# Altium schematic sheet IO_USB.schdoc
size 354 x 295 mm
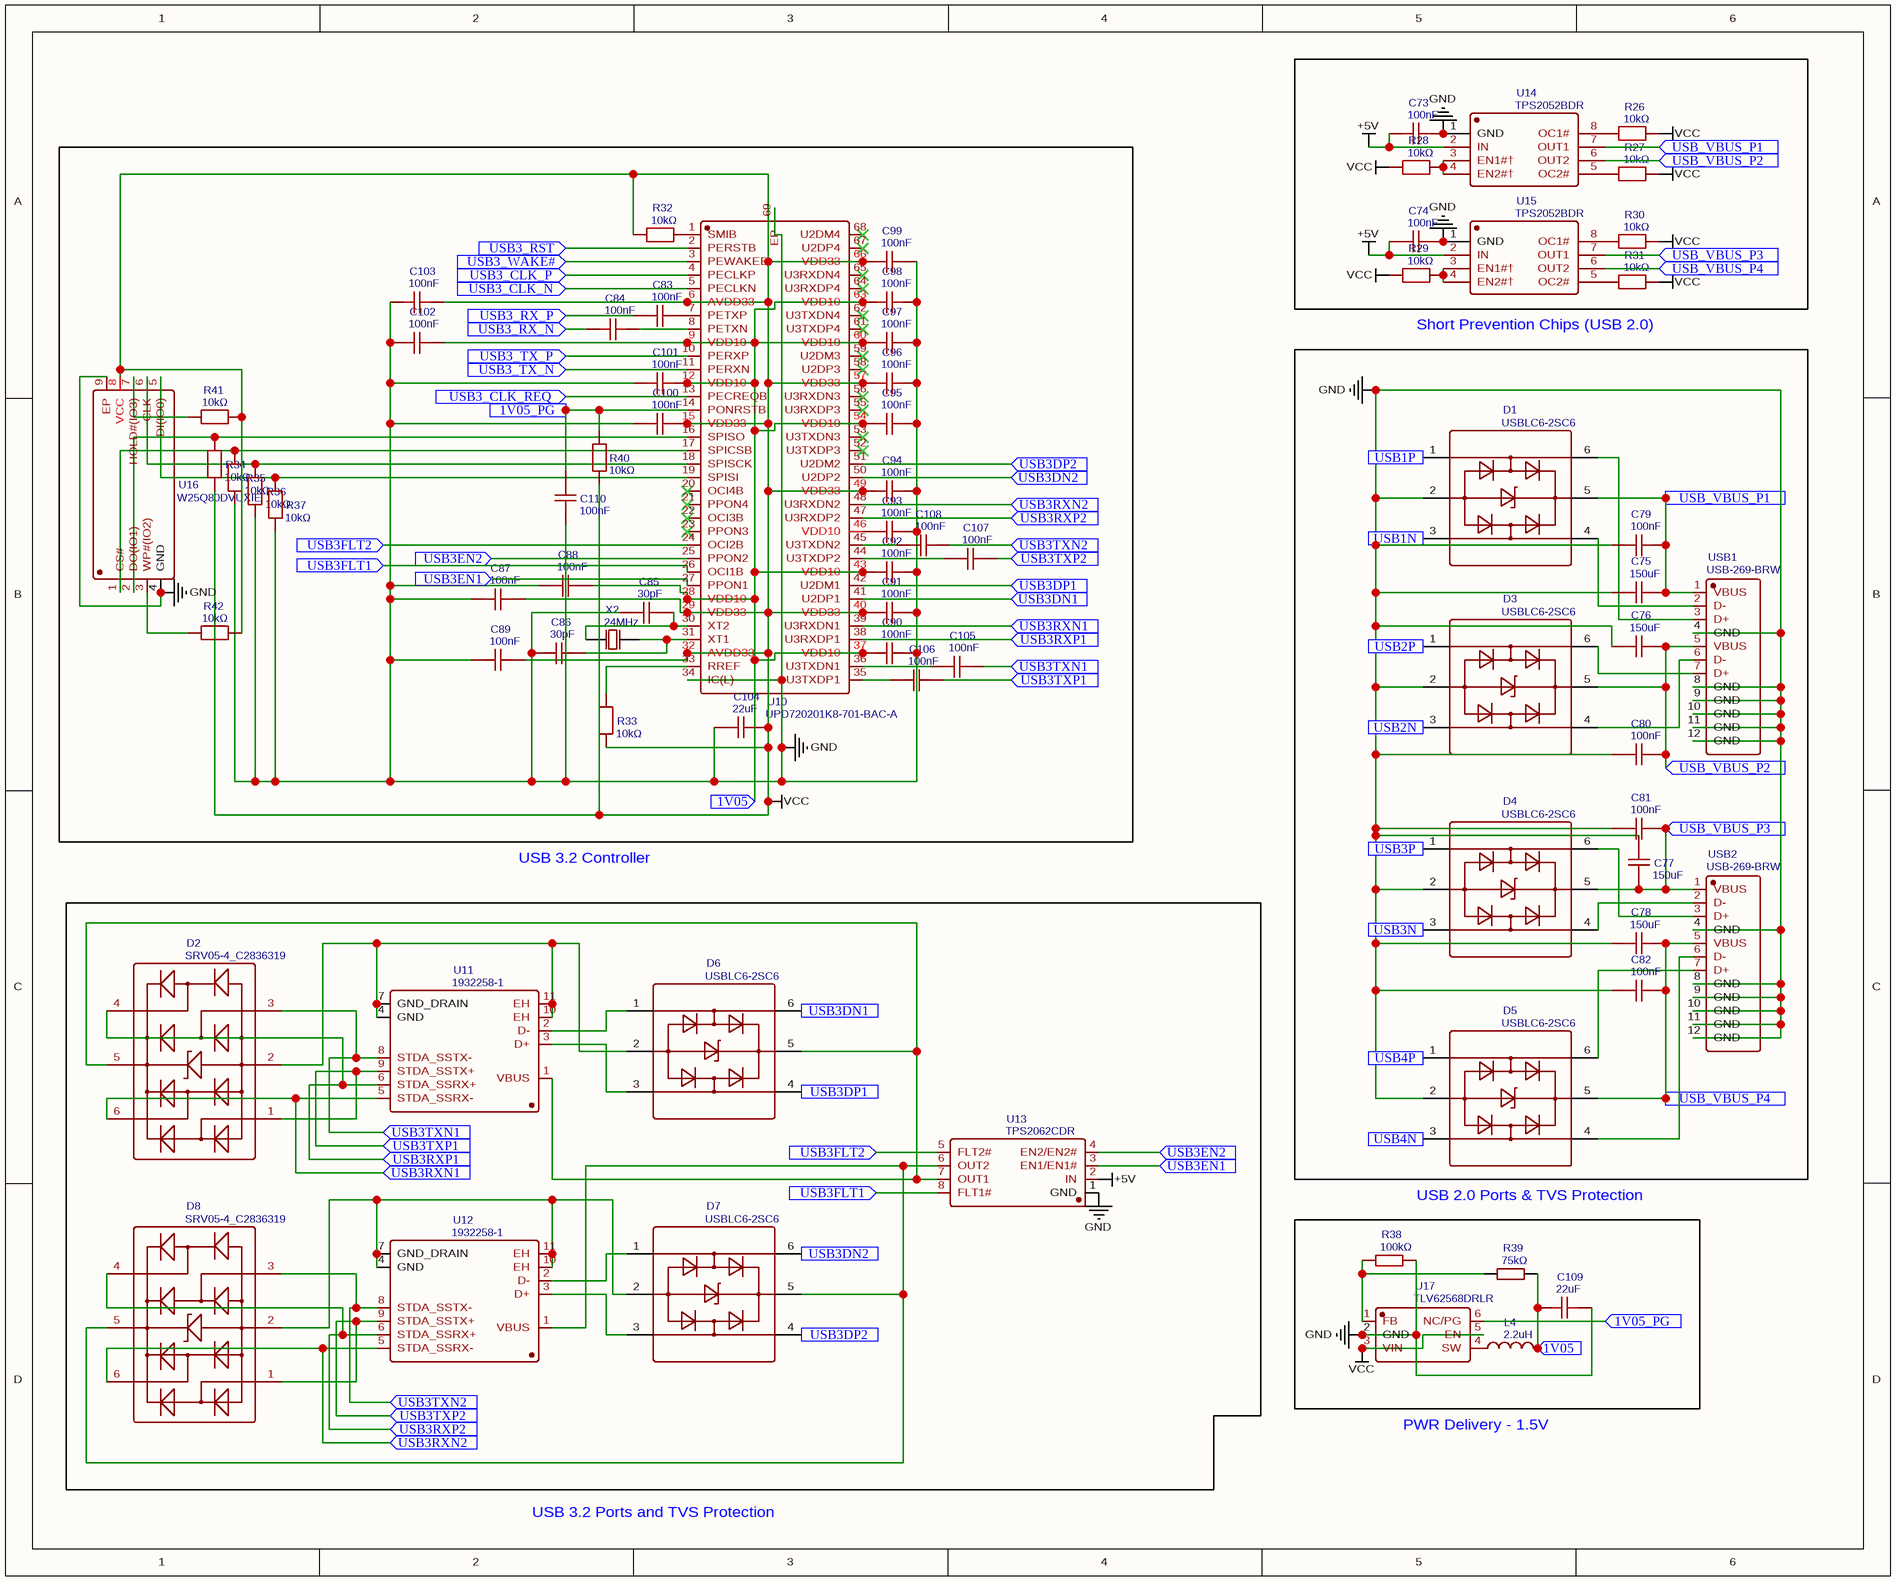
[diagram p0: IO_USB.schdoc]

## Parts
C73  100nF  [C0402]
C74  100nF  [C0402]
C75  150uF  [C1206]
C76  150uF  [C1206]
C77  150uF  [C1206]
C78  150uF  [C1206]
C79  100nF  [C0402]
C80  100nF  [C0402]
C81  100nF  [C0402]
C82  100nF  [C0402]
C83  100nF  [C0402]
C84  100nF  [C0402]
C85  30pF  [C0402]
C86  30pF  [C0402]
C87  100nF  [C0402]
C88  100nF  [C0402]
C89  100nF  [C0402]
C90  100nF  [C0402]
C91  100nF  [C0402]
C92  100nF  [C0402]
C93  100nF  [C0402]
C94  100nF  [C0402]
C95  100nF  [C0402]
C96  100nF  [C0402]
C97  100nF  [C0402]
C98  100nF  [C0402]
C99  100nF  [C0402]
C100  100nF  [C0402]
C101  100nF  [C0402]
C102  100nF  [C0402]
C103  100nF  [C0402]
C104  22uF  [C0805]
C105  100nF  [C0402]
C106  100nF  [C0402]
C107  100nF  [C0402]
C108  100nF  [C0402]
C109  22uF  [C0805]
C110  100nF  [C0402]
D1  USBLC6-2SC6  [SOT-23-6_L2.9-W1.6-P0.95-LS2.8-BL]
D2  SRV05-4_C2836319  [SOT-23-6_L2.9-W1.6-P0.95-LS2.8-BL]
D3  USBLC6-2SC6  [SOT-23-6_L2.9-W1.6-P0.95-LS2.8-BL]
D4  USBLC6-2SC6  [SOT-23-6_L2.9-W1.6-P0.95-LS2.8-BL]
D5  USBLC6-2SC6  [SOT-23-6_L2.9-W1.6-P0.95-LS2.8-BL]
D6  USBLC6-2SC6  [SOT-23-6_L2.9-W1.6-P0.95-LS2.8-BL]
D7  USBLC6-2SC6  [SOT-23-6_L2.9-W1.6-P0.95-LS2.8-BL]
D8  SRV05-4_C2836319  [SOT-23-6_L2.9-W1.6-P0.95-LS2.8-BL]
L4  2.2uH  [L0805]
R26  10kΩ  [R0402]
R27  10kΩ  [R0402]
R28  10kΩ  [R0402]
R29  10kΩ  [R0402]
R30  10kΩ  [R0402]
R31  10kΩ  [R0402]
R32  10kΩ  [R0402]
R33  10kΩ  [R0402]
R34  10kΩ  [R0402]
R35  10kΩ  [R0402]
R36  10kΩ  [R0402]
R37  10kΩ  [R0402]
R38  100kΩ  [R0603]
R39  75kΩ  [R0603]
R40  10kΩ  [R0402]
R41  10kΩ  [R0402]
R42  10kΩ  [R0402]
U10  UPD720201K8-701-BAC-A  [QFN-68_L8.0-W8.0-P0.40-BL-EP6.2]
U11  1932258-1  [USB-A-TH_1932258-1]
U12  1932258-1  [USB-A-TH_1932258-1]
U13  TPS2062CDR  [SOIC-8_L4.9-W3.9-P1.27-LS6.0-BL]
U14  TPS2052BDR  [SOIC-8_L4.9-W3.9-P1.27-LS6.0-BL]
U15  TPS2052BDR  [SOIC-8_L4.9-W3.9-P1.27-LS6.0-BL]
U16  W25Q80DVUXIE  [USON-8_L3.0-W2.0-P0.50-BL-EP_GD25QXX]
U17  TLV62568DRLR  [SOT-563_L1.6-W1.2-P0.50-LS1.6-BL]
USB1  USB-269-BRW  [USB-A-TH_USB-269-BRW]
USB2  USB-269-BRW  [USB-A-TH_USB-269-BRW]
X2  24MHz  [CRYSTAL-SMD_2P-L6.0-W3.5]

## Blocks framed on the sheet
Short Prevention Chips (USB 2.0): C75-C82 D1 D3-D5 USB1 USB2
USB 2.0 Ports & TVS Protection: C109 L4 R38 R39 U17

## Ports
1V05 (in), 1V05_PG (in), USB1N (in), USB1P (in), USB2N (in), USB2P (in), USB3_CLK_N (in), USB3_CLK_P (in), USB3_CLK_REQ (in), USB3_RST (in), USB3_RX_N (in), USB3_RX_P (in), USB3_TX_N (in), USB3_TX_P (in), USB3_WAKE# (in), USB3DN1 (in), USB3DN2 (in), USB3DP1 (in), USB3DP2 (in), USB3EN1 (in), USB3EN2 (in), USB3FLT1 (in), USB3FLT2 (in), USB3N (in), USB3P (in), USB3RXN1 (in), USB3RXN2 (in), USB3RXP1 (in), USB3RXP2 (in), USB3TXN1 (in), USB3TXN2 (in), USB3TXP1 (in), USB3TXP2 (in), USB4N (in), USB4P (in), USB_VBUS_P1 (in), USB_VBUS_P2 (in), USB_VBUS_P3 (in), USB_VBUS_P4 (in)

## Nets
+5V: C73.1 C74.1 U13.2(IN) U14.2(IN) U15.2(IN)
GND: C73.2 C74.2 C75.1 C76.1 C77.2 C78.1 C79.1 C80.1 C81.1 C82.1 C85.1 C86.1 C87.1 C88.1 C89.1 C90.2 C91.2 C92.2 C93.2 C94.2 C95.2 C96.2 C97.2 C98.2 C99.2 C100.1 C101.1 C102.1 C103.1 C104.1 C109.2 C110.1 D1.2 D3.2 D4.2 D5.2 R35.2 R36.2 R37.2 R38.2 U10.34(IC(L)) U10.69(EP) U13.1(GND) U14.1(GND) U15.1(GND) U16.4(GND) U16.9(EP) U17.2(GND) USB1.4(GND) USB1.8(GND) USB1.9(GND) USB1.10(GND) USB1.11(GND) USB1.12(GND) USB2.4(GND) USB2.8(GND) USB2.9(GND) USB2.10(GND) USB2.11(GND) USB2.12(GND)
VCC: C87.2 C88.2 C89.2 C90.1 C91.1 C92.1 C94.1 C95.1 C96.1 C97.1 C98.1 C99.1 C100.2 C101.2 C102.2 C103.2 C104.2 C109.1 L4.2 R26.2 R27.2 R28.1 R29.1 R30.2 R31.2 R32.2 R33.2 R34.2 R39.2 R40.2 R41.2 R42.2 U10.6(AVDD33) U10.9(VDD10) U10.12(VDD10) U10.15(VDD33) U10.28(VDD10) U10.29(VDD33) U10.32(AVDD33) U10.37(VDD10) U10.40(VDD33) U10.43(VDD10) U10.49(VDD33) U10.54(VDD10) U10.57(VDD33) U10.60(VDD10) U10.63(VDD10) U10.66(VDD33) U16.8(VCC) U17.3(VIN) U17.5(EN) ; port 1V05
1V05_PG: C110.2 R40.1 U10.14(PONRSTB) U17.6(NC/PG) ; port 1V05_PG
USB1N: D1.3 ; port USB1N
USB1P: D1.1 ; port USB1P
USB2N: D3.3 ; port USB2N
USB2P: D3.1 ; port USB2P
USB3_CLK_N: U10.5(PECLKN) ; port USB3_CLK_N
USB3_CLK_P: U10.4(PECLKP) ; port USB3_CLK_P
USB3_CLK_REQ: U10.13(PECREQB) ; port USB3_CLK_REQ
USB3_RST: U10.2(PERSTB) ; port USB3_RST
USB3_RX_N: C84.1 ; port USB3_RX_N
USB3_RX_P: C83.1 ; port USB3_RX_P
USB3_TX_N: U10.11(PERXN) ; port USB3_TX_N
USB3_TX_P: U10.10(PERXP) ; port USB3_TX_P
USB3_WAKE#: U10.3(PEWAKEB) ; port USB3_WAKE#
USB3DN1: D6.6 U10.41(U2DP1) ; port USB3DN1
USB3DN2: D7.6 U10.50(U2DP2) ; port USB3DN2
USB3DP1: D6.4 U10.42(U2DM1) ; port USB3DP1
USB3DP2: D7.4 U10.51(U2DM2) ; port USB3DP2
USB3EN1: U10.27(PPON1) U13.3(EN1/EN1#) ; port USB3EN1
USB3EN2: U10.25(PPON2) U13.4(EN2/EN2#) ; port USB3EN2
USB3FLT1: U10.26(OCI1B) U13.8(FLT1#) ; port USB3FLT1
USB3FLT2: U10.24(OCI2B) U13.5(FLT2#) ; port USB3FLT2
USB3N: D4.3 ; port USB3N
USB3P: D4.1 ; port USB3P
USB3RXN1: D2.6 U10.39(U3RXDN1) U11.5(STDA_SSRX-) ; port USB3RXN1
USB3RXN2: D8.6 U10.48(U3RXDN2) U12.5(STDA_SSRX-) ; port USB3RXN2
USB3RXP1: D2.4 U10.38(U3RXDP1) U11.6(STDA_SSRX+) ; port USB3RXP1
USB3RXP2: D8.4 U10.47(U3RXDP2) U12.6(STDA_SSRX+) ; port USB3RXP2
USB3TXN1: C105.2 D2.3 U11.8(STDA_SSTX-) ; port USB3TXN1
USB3TXN2: C108.2 D8.3 U12.8(STDA_SSTX-) ; port USB3TXN2
USB3TXP1: C106.2 D2.1 U11.9(STDA_SSTX+) ; port USB3TXP1
USB3TXP2: C107.2 D8.1 U12.9(STDA_SSTX+) ; port USB3TXP2
USB4N: D5.3 ; port USB4N
USB4P: D5.1 ; port USB4P
USB_VBUS_P1: C75.2 C79.2 D1.5 U14.7(OUT1) USB1.1(VBUS) ; port USB_VBUS_P1
USB_VBUS_P2: C76.2 C80.2 D3.5 U14.6(OUT2) USB1.5(VBUS) ; port USB_VBUS_P2
USB_VBUS_P3: C77.1 C81.2 D4.5 U15.7(OUT1) USB2.1(VBUS) ; port USB_VBUS_P3
USB_VBUS_P4: C78.2 C82.2 D5.5 U15.6(OUT2) USB2.5(VBUS) ; port USB_VBUS_P4
NetC83_2: C83.2 U10.7(PETXP)
NetC84_2: C84.2 U10.8(PETXN)
NetC85_2: C85.2 U10.30(XT2) X2.1(OSC1)
NetC86_2: C86.2 U10.31(XT1) X2.2(OSC2)
NetC93_1: C93.1 U10.46(VDD10)
NetC105_1: C105.1 U10.36(U3TXDN1)
NetC106_1: C106.1 U10.35(U3TXDP1)
NetC107_1: C107.1 U10.44(U3TXDP2)
NetC108_1: C108.1 U10.45(U3TXDN2)
NetD1_4: D1.4 USB1.2(D-)
NetD1_6: D1.6 USB1.3(D+)
NetD2_2: D2.2 D6.2 U11.4(GND) U11.7(GND_DRAIN) U11.10(EH) U11.11(EH)
NetD2_5: D2.5 D6.5 U11.1(VBUS) U13.7(OUT1)
NetD3_4: D3.4 USB1.6(D-)
NetD3_6: D3.6 USB1.7(D+)
NetD4_4: D4.4 USB2.2(D-)
NetD4_6: D4.6 USB2.3(D+)
NetD5_4: D5.4 USB2.6(D-)
NetD5_6: D5.6 USB2.7(D+)
NetD6_1: D6.1 U11.2(D-)
NetD6_3: D6.3 U11.3(D+)
NetD7_1: D7.1 U12.2(D-)
NetD7_2: D7.2 D8.2 U12.4(GND) U12.7(GND_DRAIN) U12.10(EH) U12.11(EH)
NetD7_3: D7.3 U12.3(D+)
NetD7_5: D7.5 D8.5 U12.1(VBUS) U13.6(OUT2)
NetL4_1: L4.1 U17.4(SW)
NetR26_1: R26.1 U14.8(OC1#)
NetR27_1: R27.1 U14.5(OC2#)
NetR28_2: R28.2 U14.3(EN1#†) U14.4(EN2#†)
NetR29_2: R29.2 U15.3(EN1#†) U15.4(EN2#†)
NetR30_1: R30.1 U15.8(OC1#)
NetR31_1: R31.1 U15.5(OC2#)
NetR32_1: R32.1 U10.1(SMIB)
NetR33_1: R33.1 U10.33(RREF)
NetR34_1: R34.1 U10.16(SPISO) U16.2(DO(IO1))
NetR35_1: R35.1 U10.17(SPICSB) U16.1(CS#)
NetR36_1: R36.1 U10.18(SPISCK) U16.6(CLK)
NetR37_1: R37.1 U10.19(SPISI) U16.5(DI(IO0))
NetR38_1: R38.1 R39.1 U17.1(FB)
NetR41_1: R41.1 U16.7(HOLD#(IO3))
NetR42_1: R42.1 U16.3(WP#(IO2))

Not connected (* = marked no-connect by the designer): U10 20(OCI4B)* 21(PPON4)* 22(OCI3B)* 23(PPON3)* 52(U3TXDP3)* 53(U3TXDN3)* 55(U3RXDP3)* 56(U3RXDN3)* 58(U2DP3)* 59(U2DM3)* 61(U3TXDP4)* 62(U3TXDN4)* 64(U3RXDP4)* 65(U3RXDN4)* 67(U2DP4)* 68(U2DM4)*

## Notes on the sheet
- USB 3.2 Controller
- PWR Delivery - 1.5V
- USB 3.2 Ports and TVS Protection

## Library data of the parts
C73 C74 C79-C84 C87-C103 C105-C108 C110 = 100nF: Manufacturer: muRata(村田); Manufacturer Part: GRM155R71H104KE14J; Contributor: lcsc; nameAlias: Value; Supplier: LCSC; Supplier Part: C2649519; JLCPCB Part Class: Extended Part; spicePre: C; spiceSymbolName: GRM155R71H104KE14J
C75-C78 = 150uF: Manufacturer: muRata(村田); Manufacturer Part: GRM31CR60J157ME11L; nameAlias: Value; Contributor: LCSC; Supplier: LCSC; Supplier Part: C528968; JLCPCB Part Class: Extended Part; spicePre: C; spiceSymbolName: GRM31CR60J157ME11L
C85 C86 = 30pF: Manufacturer: CCTC(三环); Manufacturer Part: TCC0402COG300J500AT; nameAlias: Value; Contributor: LCSC; Supplier: LCSC; Supplier Part: C696851; JLCPCB Part Class: Extended Part; spicePre: C; spiceSymbolName: TCC0402COG300J500AT
C104 C109 = 22uF: Manufacturer: muRata(村田); Manufacturer Part: GRT21BR61E226ME13L; nameAlias: Value; Contributor: LCSC; Supplier: LCSC; Supplier Part: C398931; JLCPCB Part Class: Extended Part; spicePre: C; spiceSymbolName: GRT21BR61E226ME13L
D1 D3-D7 = USBLC6-2SC6: Manufacturer: ST(意法半导体); Supplier: LCSC; Manufacturer Part: USBLC6-2SC6; Supplier Part: C7519; JLCPCB Part Class: Extended Part; spicePre: D; spiceSymbolName: USBLC6-2SC6
D2 D8 = SRV05-4_C2836319: Manufacturer: MSKSEMI(美森科); Contributor: lcsc; Supplier: LCSC; Supplier Part: C2836319; Manufacturer Part: SRV05-4; JLCPCB Part Class: Extended Part; spicePre: D; spiceSymbolName: SRV05-4_C2836319
L4 = 2.2uH: Manufacturer: TDK; Manufacturer Part: MLP2012H2R2MT0S1; nameAlias: Value; Contributor: LCSC; Supplier: LCSC; Supplier Part: C383369; JLCPCB Part Class: Extended Part; spicePre: L; spiceSymbolName: MLP2012H2R2MT0S1
R26-R37 R40-R42 = 10kΩ: Manufacturer: FOJAN(富捷); Manufacturer Part: FRC0402F1002TS; nameAlias: Value; Contributor: LCSC; Supplier: LCSC; Supplier Part: C2906861; JLCPCB Part Class: Extended Part; spicePre: R; spiceSymbolName: FRC0402F1002TS
R38 = 100kΩ: Manufacturer: FH(风华); Manufacturer Part: RS-03K1003FT; nameAlias: Value; Contributor: LCSC; Supplier: LCSC; Supplier Part: C115320; JLCPCB Part Class: Extended Part; spicePre: R; spiceSymbolName: RS-03K1003FT_C115320
R39 = 75kΩ: Manufacturer: FH(风华); Manufacturer Part: RS-03K7502FT; nameAlias: Value; Contributor: LCSC; Supplier: LCSC; Supplier Part: C140071; JLCPCB Part Class: Extended Part; spicePre: R; spiceSymbolName: RS-03K7502FT
U10 = UPD720201K8-701-BAC-A: Manufacturer: RENESAS(瑞萨)/IDT; Contributor: LCSC; Supplier: LCSC; Supplier Part: C355375; Manufacturer Part: UPD720201K8-701-BAC-A; JLCPCB Part Class: Extended Part; spicePre: U; spiceSymbolName: UPD720201K8-701-BAC-A
U11 U12 = 1932258-1: Manufacturer: TE Connectivity(泰科电子); Contributor: lcsc; Supplier: LCSC; Supplier Part: C5118692; Manufacturer Part: 1932258-1; JLCPCB Part Class: Extended Part; spicePre: U; spiceSymbolName: 1932258-1
U13 = TPS2062CDR: Manufacturer: TI(德州仪器); Contributor: LCSC; Supplier: LCSC; Supplier Part: C2149911; Manufacturer Part: TPS2062CDR; JLCPCB Part Class: Extended Part; spicePre: U; spiceSymbolName: TPS2062CDR
U14 U15 = TPS2052BDR: Manufacturer: TI(德州仪器); Contributor: LCSC; Supplier: LCSC; Manufacturer Part: TPS2052BDR; Supplier Part: C130049; JLCPCB Part Class: Extended Part; spicePre: U; spiceSymbolName: TPS2052BDR
U16 = W25Q80DVUXIE: Manufacturer: Winbond(华邦); Contributor: LCSC; Supplier: LCSC; Supplier Part: C401667; Manufacturer Part: W25Q80DVUXIE; JLCPCB Part Class: Extended Part; spicePre: U; spiceSymbolName: W25Q80DVUXIE
U17 = TLV62568DRLR: Manufacturer: TI(德州仪器); Contributor: LCSC; Supplier: LCSC; Supplier Part: C398370; Manufacturer Part: TLV62568DRLR; JLCPCB Part Class: Extended Part; spicePre: U; spiceSymbolName: TLV62568DRLR
USB1 USB2 = USB-269-BRW: Manufacturer: XUNPU(讯普); Contributor: LCSC; Supplier: LCSC; Supplier Part: C720548; Manufacturer Part: USB-269-BRW; JLCPCB Part Class: Extended Part; spicePre: U; spiceSymbolName: USB-269-BRW
X2 = 24MHz: Manufacturer: ABRACON; Manufacturer Part: ABM7-24.000MHZ-D2Y-T; nameAlias: Value; Contributor: LCSC; Supplier: LCSC; Supplier Part: C179634; JLCPCB Part Class: Extended Part; spicePre: X; spiceSymbolName: ABM7-24.000MHZ-D2Y-T